# EAGLE schematic magspoof (EAGLE 8.4.1)
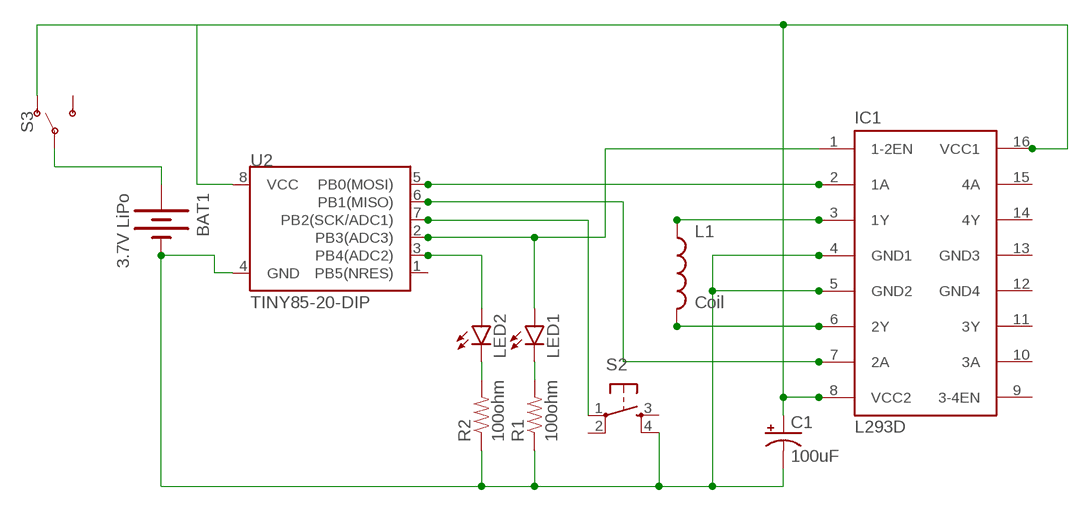
[diagram p0: schematic, sheet 1]

## Parts
BAT1  3.7V LiPo  BATTERYLIPO-TABS  [LIPO-110-TABS]
C1  100uF  CAP_POLPTH1  [CPOL-RADIAL-100UF-25V]
IC1  L293D  [DIL16]
L1  Coil  INDUCTORAXIAL-0.6  [AXIAL-0.6]
LED1  LED-3MM-NO_SILK  [LED3MM-NS]
LED2  LED-3MM-NO_SILK  [LED3MM-NS]
R1  100ohm  RESISTORAXIAL-0.3  [AXIAL-0.3]
R2  100ohm  RESISTORAXIAL-0.3  [AXIAL-0.3]
S2  TAC_SWITCHPTH  [TACTILE-PTH]
S3  SWITCH-SPDT-PTH-11.6X4.0MM  [SWITCH_SPDT_PTH_11.6X4.0MM]
U2  TINY85-20-DIP  ATTINY45TINY85-20-DIP  [DIP08_MCU]

## Nets
N$1: IC1.3(1Y) L1.P$1
N$2: IC1.6(2Y) L1.P$2
N$3: IC1.2(1A) U2.5(PB0(MOSI))
N$4: IC1.7(2A) U2.6(PB1(MISO))
N$5: IC1.1(1-2EN) LED1.A U2.2(PB3(ADC3))
N$6: LED2.K(C) R2.P$2
N$7: LED1.K(C) R1.P$2
N$8: S2.1 U2.7(PB2(SCK/ADC1))
N$9: LED2.A U2.3(PB4(ADC2))
N$10: BAT1.- C1.2(-) IC1.4(GND1) IC1.5(GND2) R1.P$1 R2.P$1 S2.4 U2.4(GND)
N$11: BAT1.+ S3.2(P)
N$12: C1.1(+) IC1.8(VCC2) IC1.16(VCC1) S3.1(O) U2.8(VCC)
Unconnected: IC1.9(3-4EN) IC1.10(3A) IC1.11(3Y) IC1.14(4Y) IC1.15(4A) S2.2 S2.3 S3.3(S) U2.1(PB5(NRES))

## Power pins joined to a net without a drawn wire
GND3: IC1.13(GND3)
GND4: IC1.12(GND4)

## Library data of the parts
BAT1 = SparkFun-Electromechanical:BATTERY: Battery Holders Various common sizes : AA, AAA, 20mm coin cell and 12mm coin cell. 20MM_4LEGS, BATT-10373
C1 = SparkFun-Capacitors:CAP_POL: Capacitor Polarized These are standard SMD and PTH capacitors. Normally 10uF, 47uF, and 100uF in electrolytic and tantalum varieties. Always verify the external diameter of the through hole cap, it varies with capacity, voltage, and manufacturer. The EIA devices should be standard.
IC1 = st-microelectronics:L293D: PUSH-PULL 4 CHANNEL DRIVER; MPN: L293D; OC_FARNELL: 9589619; OC_NEWARK: 56P8249
L1 = SparkFun-Passives:INDUCTOR: Inductors Basic Inductor/Choke - 0603 and 1206. Footprints are not proven and vary greatly between part numbers. SRN6045- 33uH, 20% 1.4A SDR0403-560KL - 56uH, 10%, 500mA RMS/740mA peak
LED1 LED2 = SparkFun-LED:LED: LEDs Standard schematic elements and footprints for 5mm, 3mm, 1206, and 0603 sized LEDs. 5mm - Spark Fun Electronics SKU : COM-00529 (and others)
R1 R2 = SparkFun-Passives:RESISTOR: Resistor Basic schematic elements and footprints for 0603, 1206, and PTH resistors.
S2 = SparkFun-Retired:TAC_SWITCH: Momentary Switch Button commonly used for reset or general input. Spark Fun Electronics SKU : COM-00097 SMT- SWCH-08247
S3 = SparkFun-Switches:SWITCH-SPDT: Single Pole, Double Throw (SPDT) Switch Single-pole, double-throw (SPDT) switch. Variant Overview SMD-AYZ0202 Surface Mount DPDT Switch <https://www.sparkfun.com/products/597> (COM-00597) Used on e.g. LilyPad Arduino USB - ATmega32U4 Board <https://www.sparkfun.com/products/12049> PTH-11.6X4.0MM SPDT Mini Power Switch <https://www.sparkfun.com/products/102> (COM-00102) Used on e.g. SparkFun Simon Says - Through-Hole Soldering Kit <https://www.sparkfun.com/products/10547> (KIT-10547) PTH-11.6X4.0MM-KIT KIT version of SPDT Mini Power Switch - Simplifies soldering by removing tStop of switch pins - only one side can be soldered. PTH-11.6X4.0MM-LOCK LOCK version of SPDT Mini Power Switch - Offset pins hold switch in place for easier soldering. SMD-RIGHT-ANGLE Surface Mount Right Angle Switch <https://www.sparkfun.com/products/10860> (COM-10860) Used on e.g. SparkFun ESP8266 Thing <https://www.sparkfun.com/products/13231>; PROD_ID: SWCH-08261; SF_SKU: COM-00102
U2 = SparkFun-Retired:ATTINY45: Atmel 8-pin 2/4/8kB flash uC Retired; PROD_ID: IC-09445